# EAGLE design ausbee_carte_alim (EAGLE 6.3)
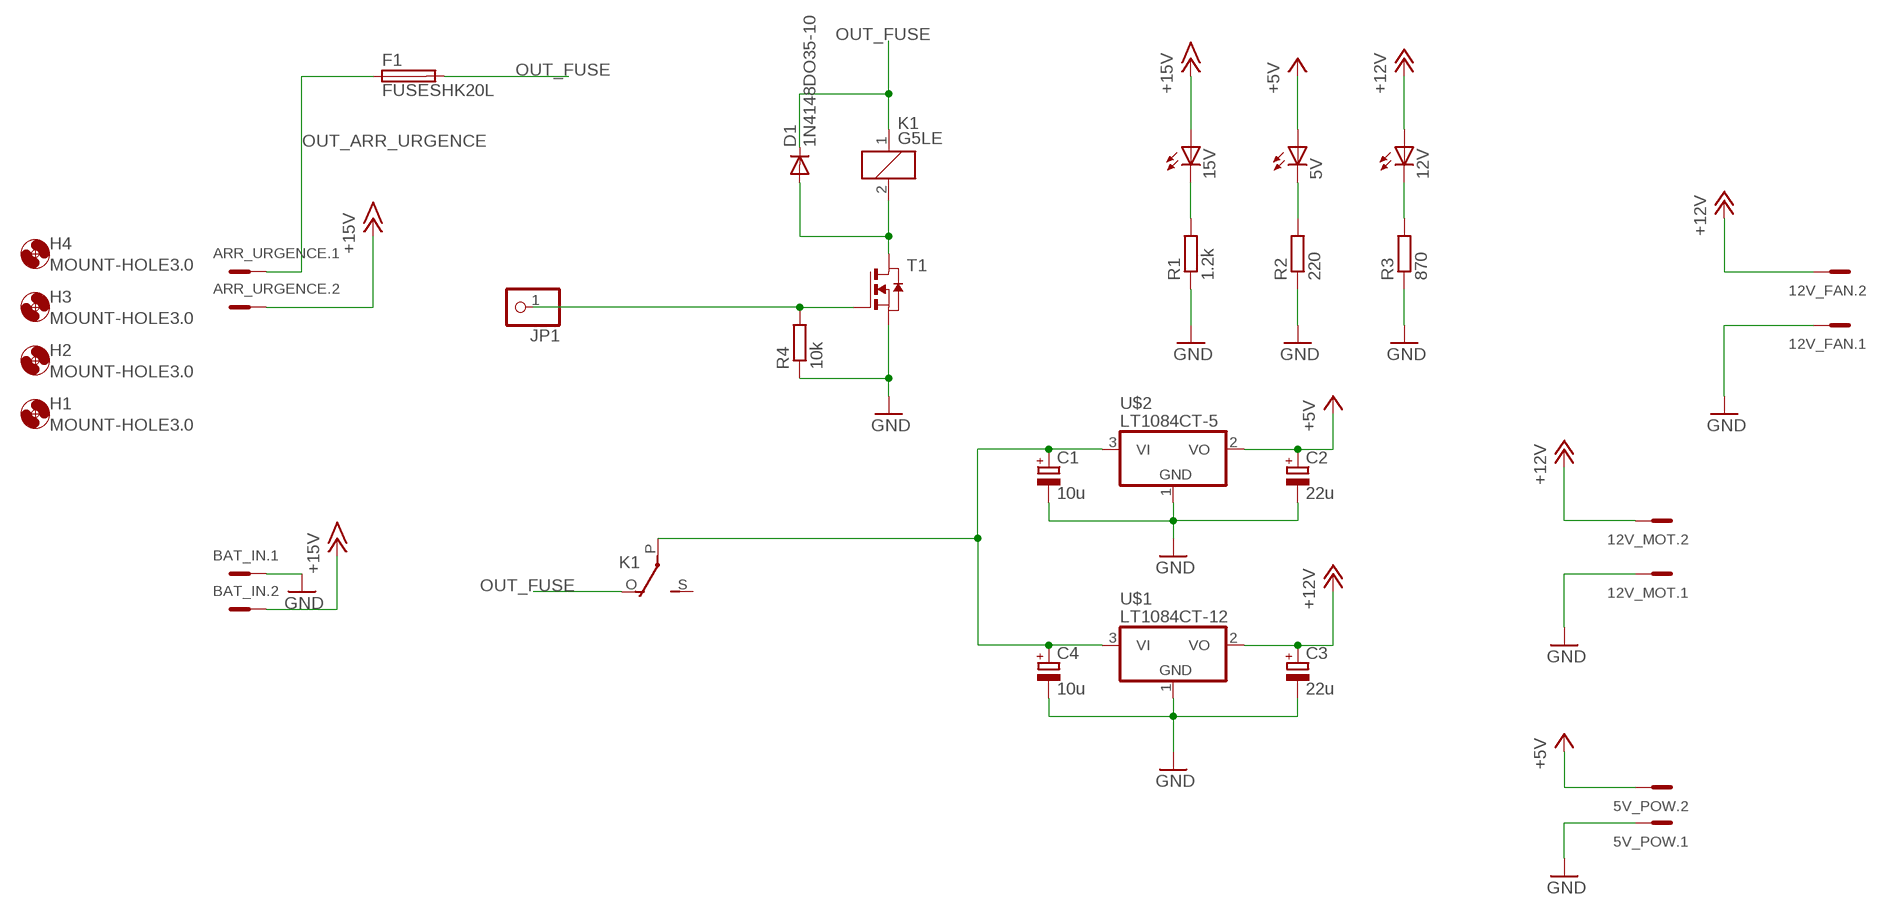
[diagram p0: schematic, sheet 1]

## Parts
5V  LED3MM  [LED3MM]
5V_POW  MCV2  [MCV2]
12V  LED3MM  [LED3MM]
12V_FAN  MCV2  [MCV2]
12V_MOT  MCV2  [MCV2]
15V  LED3MM  [LED3MM]
ARR_URGENCE  MCV2  [MCV2]
BAT_IN  MCV2  [MCV2]
C1  10u  CPOL-EUE5-8.5  [E5-8,5]
C2  22u  CPOL-EUCT7343  [CT7343]
C3  22u  CPOL-EUCT7343  [CT7343]
C4  10u  CPOL-EUE5-8.5  [E5-8,5]
D1  1N4148DO35-10  [DO35-10]
F1  FUSESHK20L  [SHK20L]
H1  MOUNT-HOLE3.0  [3,0]
H2  MOUNT-HOLE3.0  [3,0]
H3  MOUNT-HOLE3.0  [3,0]
H4  MOUNT-HOLE3.0  [3,0]
JP1  PINHD-1X1  [1X01]
K1  G5LE  [G5LE]
R1  1.2k  R-EU_0309/V  [0309V]
R2  220  R-EU_0309/V  [0309V]
R3  870  R-EU_0309/V  [0309V]
R4  10k  R-EU_0309/V  [0309V]
T1  NMOSSOT23  [SOT-23]
U$1  LT1084CT-12  [TO220V]
U$2  LT1084CT-5  [TO220V]

## Nets
+5V: 5V.A 5V_POW.2 C2.+ U$2.2(VO)
+12V: 12V.A 12V_FAN.2 12V_MOT.2 C3.+ U$1.2(VO)
+15V: 15V.A ARR_URGENCE.2 BAT_IN.2
GND: 5V_POW.1 12V_FAN.1 12V_MOT.1 BAT_IN.1 C1.- C2.- C3.- C4.- R1.1 R2.1 R3.1 R4.1 T1.2(S) U$1.1(GND) U$2.1(GND)
N$1: 12V.K(C) R3.2
N$2: 5V.K(C) R2.2
N$3: 15V.K(C) R1.2
N$4: C1.+ C4.+ K1.P(2:P) U$1.3(VI) U$2.3(VI)
N$5: D1.A K1.2 T1.1(D)
N$6: JP1.1 R4.2 T1.3(G)
OUT_ARR_URGENCE: ARR_URGENCE.1 F1.1A
OUT_FUSE: D1.C F1.2A K1.1 K1.O(2:O)
Unconnected: K1.S(2:S)

## Library data of the parts
5V 12V 15V = led:LED: LED OSRAM: - CHIPLED LG R971, LG N971, LY N971, LG Q971, LY Q971, LO R971, LY R971 LH N974, LH R974 LS Q976, LO Q976, LY Q976 LO Q996 - Hyper CHIPLED LW Q18S LB Q993, LB Q99A, LB R99A - SideLED LS A670, LO A670, LY A670, LG A670, LP A670 LB A673, LV A673, LT A673, LW A673 LH A674 LY A675 LS A676, LA A676, LO A676, LY A676, LW A676 LS A679, LY A679, LG A679 - Hyper Micro SIDELED® LS Y876, LA Y876, LO Y876, LY Y876 LT Y87S - SmartLED LW L88C, LW L88S LB L89C, LB L89S, LG L890 LS L89K, LO L89K, LY L89K LS L896, LA L896, LO L896, LY L896 - TOPLED LS T670, LO T670, LY T670, LG T670, LP T670 LSG T670, LSP T670, LSY T670, LOP T670, LYG T670 LG T671, LOG T671, LSG T671 LB T673, LV T673, LT T673, LW T673 LH T674 LS T676, LA T676, LO T676, LY T676, LB T676, LH T676, LSB T676, LW T676 LB T67C, LV T67C, LT T67C, LS T67K, LO T67K, LY T67K, LW E67C LS E67B, LA E67B, LO E67B, LY E67B, LB E67C, LV E67C, LT E67C LW T67C LS T679, LY T679, LG T679 LS T770, LO T770, LY T770, LG T770, LP T770 LB T773, LV T773, LT T773, LW T773 LH T774 LS E675, LA E675, LY E675, LS T675 LS T776, LA T776, LO T776, LY T776, LB T776 LHGB T686 LT T68C, LB T68C - Hyper Mini TOPLED® LB M676 - Mini TOPLED Santana® LG M470 LS M47K, LO M47K, LY M47K Source: http://www.osram.convergy.de LUXEON: - LUMILED® LXK2-PW12-R00, LXK2-PW12-S00, LXK2-PW14-U00, LXK2-PW14-V00 LXK2-PM12-R00, LXK2-PM12-S00, LXK2-PM14-U00 LXK2-PE12-Q00, LXK2-PE12-R00, LXK2-PE12-S00, LXK2-PE14-T00, LXK2-PE14-U00 LXK2-PB12-K00, LXK2-PB12-L00, LXK2-PB12-M00, LXK2-PB14-N00, LXK2-PB14-P00, LXK2-PB14-Q00 LXK2-PR12-L00, LXK2-PR12-M00, LXK2-PR14-Q00, LXK2-PR14-R00 LXK2-PD12-Q00, LXK2-PD12-R00, LXK2-PD12-S00 LXK2-PH12-R00, LXK2-PH12-S00 LXK2-PL12-P00, LXK2-PL12-Q00, LXK2-PL12-R00 Source: www.luxeon.com KINGBRIGHT: KA-3528ASYC Source: www.kingbright.com
5V_POW 12V_FAN 12V_MOT ARR_URGENCE BAT_IN = con-phoenix-381_l:MCV2: Mini-Combicon 3.81mm vertikal 2polig (ohne Gegenstecker)
C1-C4 = rcl:CPOL-EU: POLARIZED CAPACITOR, European symbol
D1 = diode:1N4148: DIODE high speed (Philips)
F1 = fuse:FUSE: Fuse; OC_FARNELL: unknown; OC_NEWARK: unknown
H1-H4 = holes:MOUNT-HOLE: MOUNTING HOLE with drill center marker
JP1 = pinhead:PINHD-1X1: PIN HEADER
K1 = relay:G5LE: RELAY 1 x switch, 10 A/120 V AC, 8 A/30 V DC, Omron; OC_FARNELL: unknown; OC_NEWARK: unknown
R1-R4 = rcl:R-EU_: RESISTOR, European symbol
T1 = zetex:NMOSSOT23: MOS FET; OC_FARNELL: unknown; OC_NEWARK: unknown
U$1 = perso_lib:LT1084CT-12
U$2 = perso_lib:LT1084CT-5

## Board
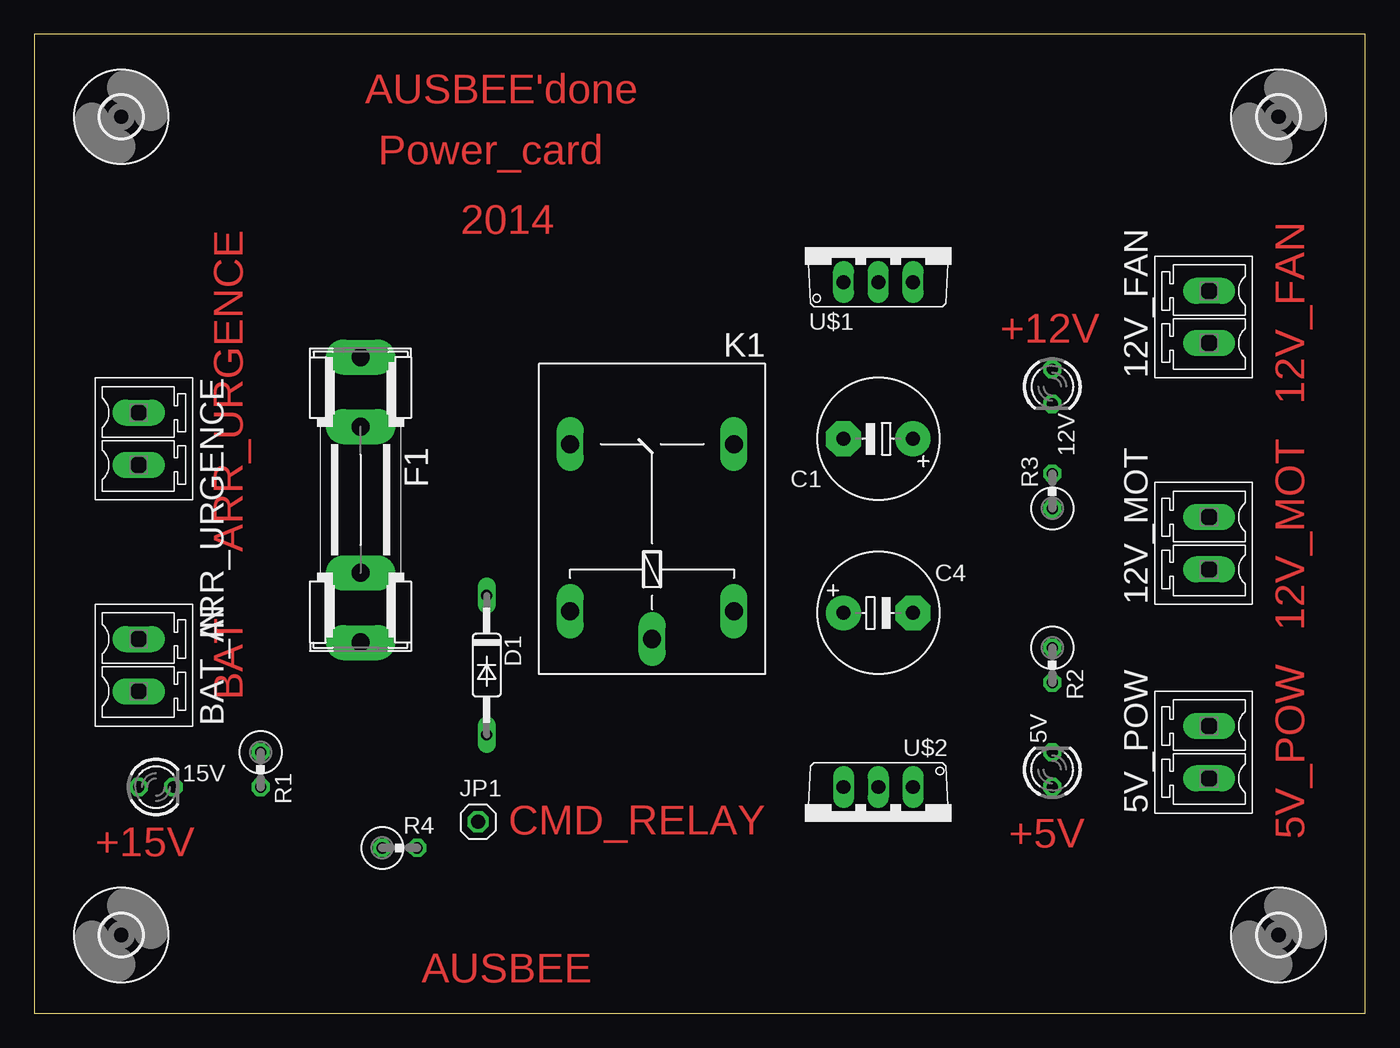
[diagram p1: board, top side]
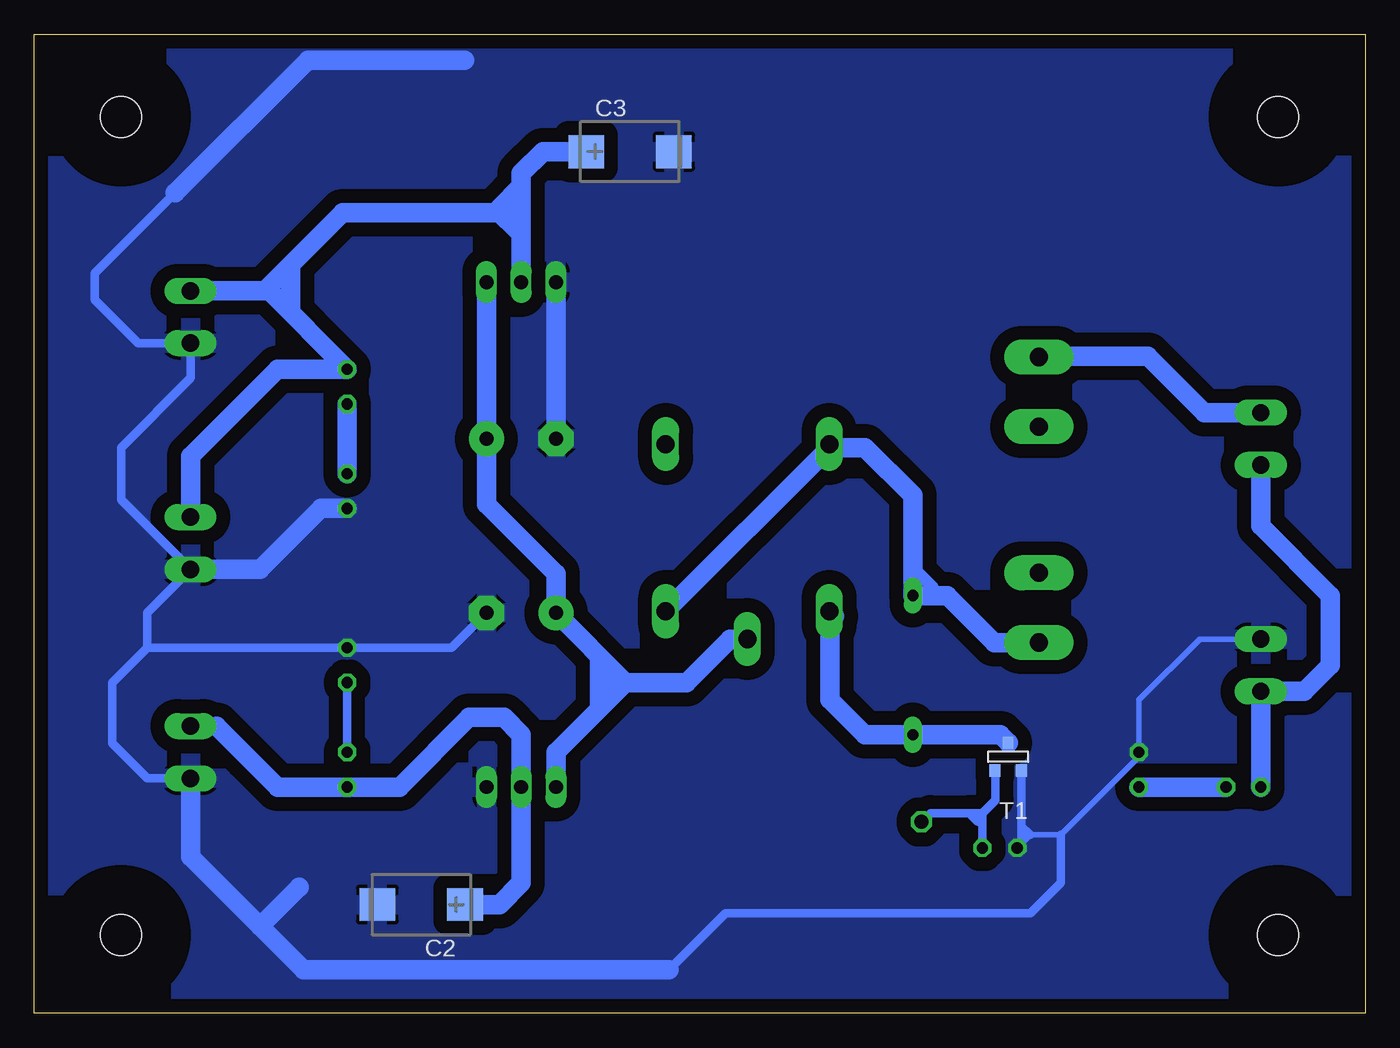
[diagram p2: board, bottom side, seen from below]

Size 97.14 x 71.42 mm. Coordinates in mm from the lower left corner, seen from the top.
Outline: 0,0 97.14,0 97.14,71.42 0,71.42 0,0
Copper layers (1*16): Top 0.035mm / dielectric 1.5mm / Bottom 0.035mm
Design rules "default": minimum track width 10mil, minimum drill 24mil, track to track 8mil, track to pad 8mil, pad to pad 8mil, via to via 8mil, smd to smd 8mil, copper to edge 40mil, drill to drill 8mil, minimum pad ring 10mil, minimum via ring 8mil, stop-mask expansion 4mil, vias tented up to drill 0mil, thermal gap 10mil

### Footprints (pad centres in the part's own frame; a part is rotated, then mirrored left to right if it is on the bottom)
LED3MM = drill 0.813 octagon: A -1.27,0; K 1.27,0
MCV2 = drill 1.27 pad 1.905 long: 1 -1.905,0; 2 1.905,0
E5-8,5 = drill 1.016 pad 2.54: + -2.54,0 | drill 1.016 pad 2.54 octagon: - 2.54,0
CT7343 = smd 2.6 x 2.4: + -3.2,0; - 3.2,0
DO35-10 = drill 0.813 long: A 5.08,0; C -5.08,0
SHK20L = drill 1.321 pad 2.54 long: 1A -10.414,0; 1B -5.334,0; 2A 10.414,0; 2B 5.334,0
3,0 = hole 3: 0,0
1X01 = drill 1.016 octagon: 1 0,0
G5LE = drill 1.321 long: 1 -7.493,-5.969; 2 -7.493,5.969; O 4.699,5.969; P -9.525,0; S 4.699,-5.969
0309V = drill 0.813 octagon: 1 -1.27,0; 2 1.27,0
SOT-23 = smd 0.787 x 0.889: 1 0.025,-1.016; 2 -0.94,1.016; 3 0.991,1.016
TO220V = drill 1.016 long: 1 -2.54,-2.54; 2 0,-2.54; 3 2.54,-2.54

### Placement (x,y rotation side)
5V  74.3,17.78 90 top
5V_POW  85.72,19.05 90 top
12V  74.3,45.72 270 top
12V_FAN  85.72,50.8 90 top
12V_MOT  85.72,34.29 90 top
15V  8.89,16.51 0 top
ARR_URGENCE  7.62,41.91 270 top
BAT_IN  7.62,25.4 270 top
C1  61.59,41.91 180 top
C2  68.9,7.94 180 bottom
C3  53.66,62.87 0 bottom
C4  61.59,29.21 0 top
D1  33.02,25.4 270 top
F1  23.81,37.47 270 top
H1  6.35,5.71 0 top
H2  90.81,5.71 0 top
H3  90.81,65.41 0 top
H4  6.35,65.41 0 top
JP1  32.38,13.97 0 top
K1  45.09,36.83 90 top
R1  16.51,17.78 270 top
R2  74.3,25.4 270 top
R3  74.3,38.1 90 top
R4  26.67,12.06 0 top
T1  26.04,18.73 180 bottom
U$1  61.59,55.88 0 top
U$2  61.59,13.97 180 top

### Tracks (layer width: path | path; a pad name or v marks a point on that pad's centre or on a via)
+5V
  Bottom 1.27: 83.82,20.95 5V_POW.2
  Bottom 1.422: 83.82,20.95 79.38,16.51 5V.A 70.48,16.51 65.41,21.59 62.87,21.59 61.59,20.32 U$2.2 61.59,9.53 63.18,7.94 C2.+
+12V
  Bottom 1.422: 12V_FAN.2 80.33,52.7 | 80.33,52.7 80.01,52.7 12V.A 79.38,46.99 85.72,40.64 12V_MOT.2 | 80.33,52.7 74.61,58.42 61.91,58.42 61.59,58.1 | C3.+ 60.01,62.87 61.59,61.28 61.59,60.33 | 61.59,60.33 61.59,58.1 | 61.59,58.1 U$1.2 | 61.59,60.33 63.18,58.74 63.18,58.42 61.91,57.15
+15V
  Bottom 1.422: ARR_URGENCE.2 7.62,35.56 2.54,30.48 2.54,25.4 4.45,23.5 BAT_IN.2 15V.A
GND
  Bottom 0.406: BAT_IN.1 12.06,27.3 16.51,22.86 R1.1 16.51,18.73 22.23,13.02 24.45,13.02 R4.1 25.09,12.37
  Bottom 0.61: 88.9,26.67 R2.1 66.67,26.67 C4.- | 88.9,26.67 91.44,24.13 91.44,19.68 88.9,17.14 5V_POW.1 | 88.9,26.67 88.9,29.21 12V_MOT.1 90.81,37.47 90.81,41.27 85.72,46.35 12V_FAN.1 89.53,48.9 92.71,52.07 92.71,53.98 86.84,59.85 86.36,60.33 | 22.23,13.02 22.23,9.53 24.45,7.3 46.67,7.3 50.8,3.17 | T1.2 25.09,12.37 | 24.45,13.02 25.08,13.65
  Bottom 1.422: U$1.1 C1.- | R3.1 76.2,36.83 80.64,32.38 12V_MOT.1 | 80.64,6.35 85.72,11.43 5V_POW.1 | 65.72,69.53 77.15,69.53 86.84,59.85 | 77.79,9.21 80.64,6.35 | 50.8,3.17 77.47,3.17 80.64,6.35
  pour Bottom (isolate 1.016): -2.54,73.03 99.06,73.03 99.06,-3.17 -2.54,-3.17
N$1
  Bottom 1.422: R3.2 12V.K
N$2
  Bottom 0.61: 5V.K R2.2
N$3
  Bottom 1.422: 15V.K R1.2
N$4
  Bottom 1.422: U$1.3 C1.+ 64.14,37.15 59.05,32.07 C4.+ 53.98,24.13 | K1.P 46.35,27.3 49.53,24.13 53.98,24.13 | U$2.3 59.05,19.05 53.98,24.13
N$5
  Bottom 1.422: 38.73,28.96 K1.2 39.05,29.27 39.05,22.86 36.51,20.32 D1.A 26.63,20.32 T1.1
N$6
  Bottom 0.406: 26.99,17.68 T1.3
  Bottom 0.61: R4.2 27.94,14.61 | 27.94,14.61 26.99,15.56 26.99,17.68 | JP1.1 31.75,14.61 28.89,14.61 | 28.89,14.61 27.94,14.61 | 28.26,13.97 28.89,14.61
N$7
  Bottom 1.422: 55.88,25.72 55.88,22.54
N$8
  Bottom 0.61: 54.93,24.77 54.93,23.81 55.24,23.81
N$9
  Bottom 1.422: 78.42,54.29 78.42,51.44
OUT_ARR_URGENCE
  Bottom 1.422: ARR_URGENCE.1 11.75,43.81 15.88,47.94 23.75,47.94 F1.1A
OUT_FUSE
  Bottom 0.61: 31.43,31.11 33.02,32.7 33.02,32.38 31.75,31.11 31.75,30.8 31.43,30.48
  Bottom 1.016: K1.O 39.12,41.27
  Bottom 1.422: K1.1 39.12,41.27 36.51,41.27 33.02,37.78 33.02,32.7 D1.C 31.43,30.48 30.48,30.48 27.05,27.05 F1.2A

### Text on the board
Top: AUSBEE'done | Power_card | 2014 | +12V | 12V_FAN | ARR_URGENCE | 12V_MOT | BAT | CMD_RELAY | 5V_POW | +5V | +15V | AUSBEE